# Altium project EDR_SEM_4.PrjPcb
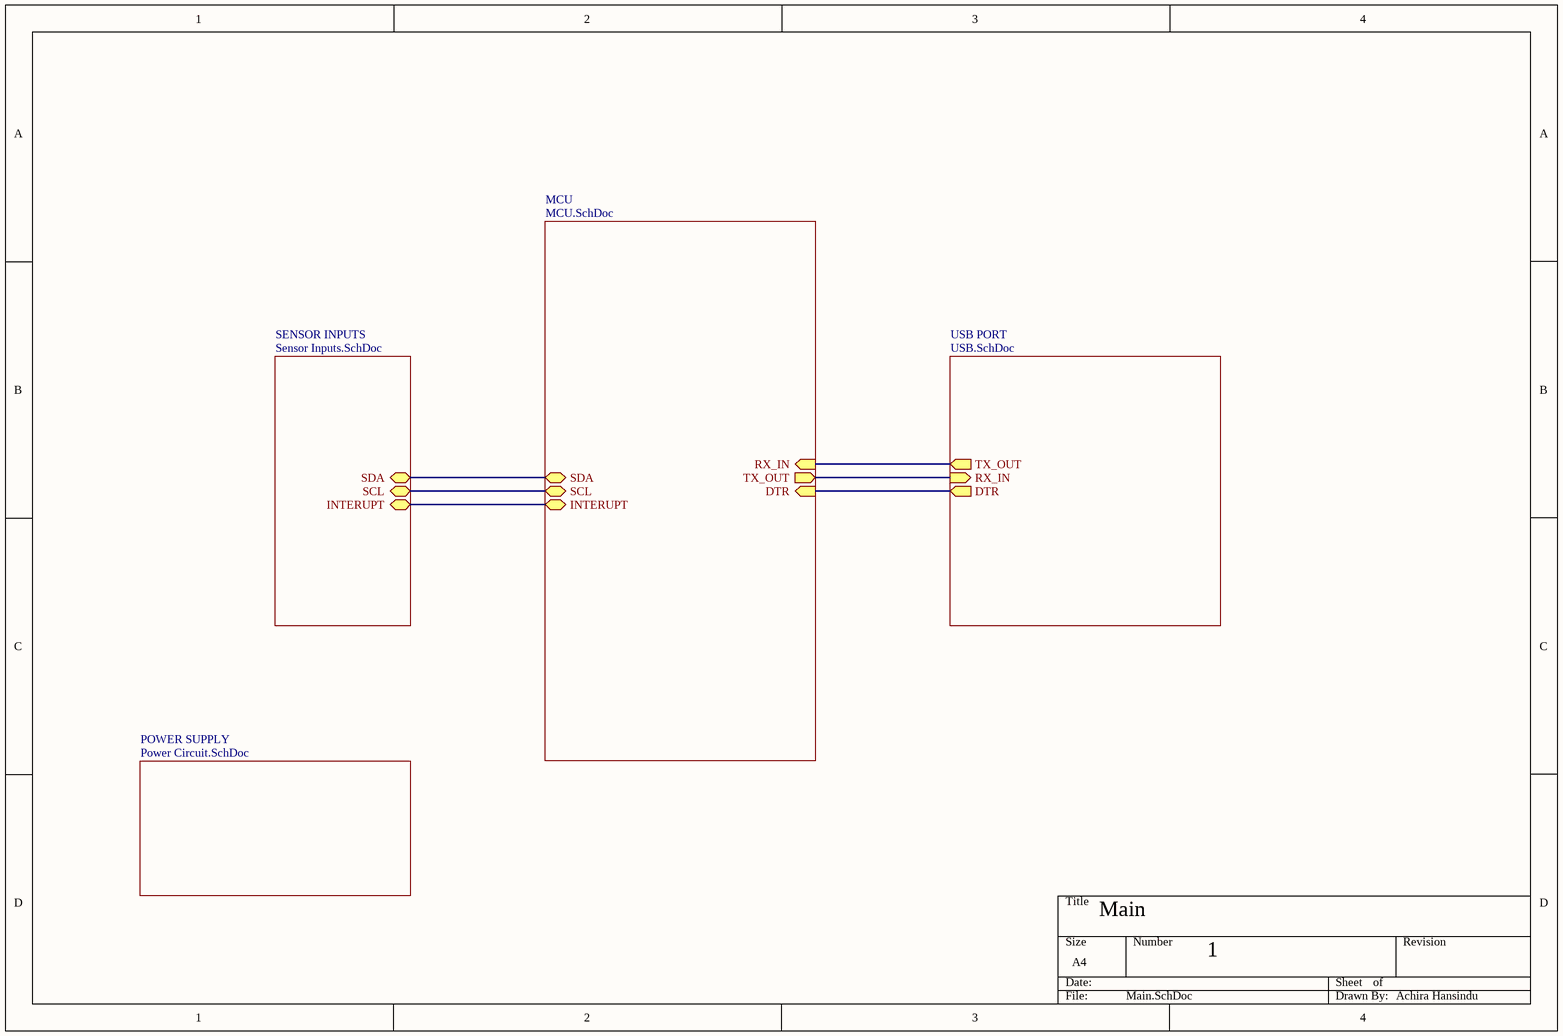
[diagram p0: Main.SchDoc]
5 sheets, 28 parts. Net scope: hierarchical (ports join the sheet entries above them; power ports are global).
Board file: PCB1.PcbDoc
Sheets:
  Main.SchDoc
    MCU = MCU.SchDoc
    POWER SUPPLY = Power Circuit.SchDoc
    SENSOR INPUTS = Sensor Inputs.SchDoc
    USB PORT = USB.SchDoc

## Sheet Main.SchDoc
size A4; SheetNumber: 1; SheetTotal: 5

### Sub-sheets
MCU = MCU.SchDoc: SDA (bidir), SCL (bidir), INTERUPT (bidir), RX_IN (in), TX_OUT (out), DTR (in)
POWER SUPPLY = Power Circuit.SchDoc: no entries
SENSOR INPUTS = Sensor Inputs.SchDoc: SDA (bidir), SCL (bidir), INTERUPT (bidir)
USB PORT = USB.SchDoc: TX_OUT (out), RX_IN (in), DTR (out)

### Nets
NetC1_1: sheet MCU/DTR, sheet USB PORT/DTR
NetD1_1: sheet MCU/TX_OUT, sheet USB PORT/RX_IN
NetD2_1: sheet MCU/RX_IN, sheet USB PORT/TX_OUT
NetJ1_2: sheet MCU/SDA, sheet SENSOR INPUTS/SDA
NetJ1_3: sheet MCU/SCL, sheet SENSOR INPUTS/SCL
NetJ1_4: sheet MCU/INTERUPT, sheet SENSOR INPUTS/INTERUPT

### Notes on the sheet
- Main
- 1
- Achira Hansindu

## Sheet MCU.SchDoc
size A4; SheetNumber: 3; SheetTotal: 5
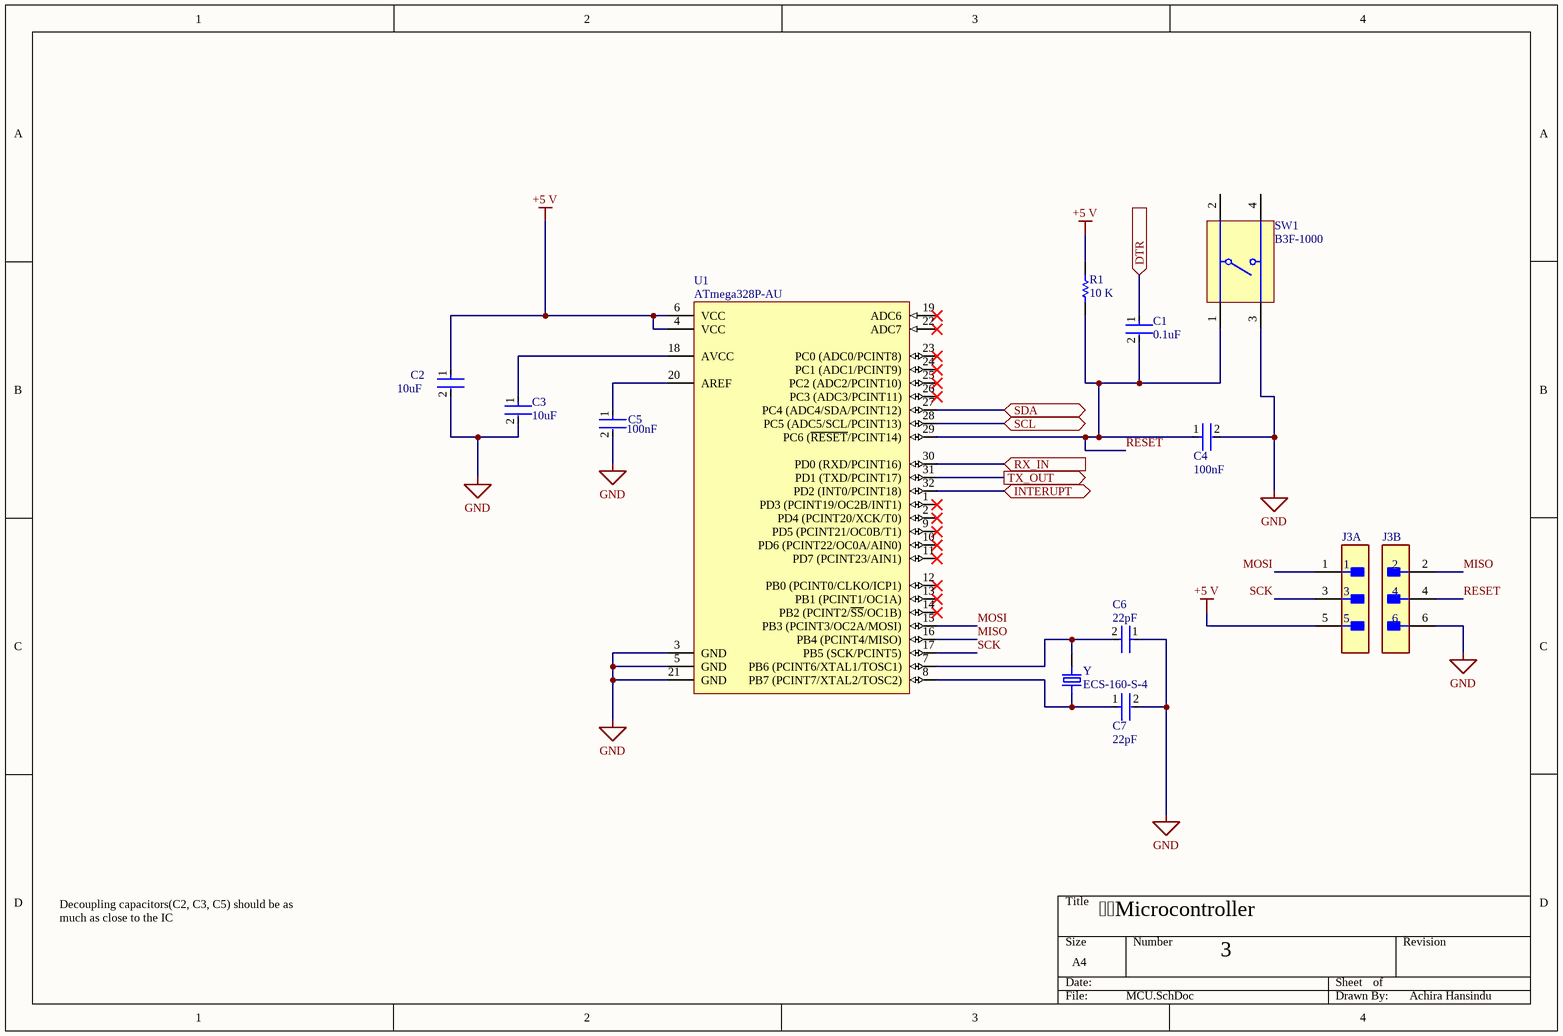
[diagram p1: MCU.SchDoc]

### Parts
C1  Capacitance: 0.1uF  [FP-GRM31M-0_15-IPC_A]  (hidden comment: GRM31M1X1H104JA01L)
C2  Capacitance: 10uF  [FP-C1206C106K4PACTU-MFG]  (hidden comment: C1206C106K4PACTU)
C3  Capacitance: 10uF  [FP-C1206C106K4PACTU-MFG]  (hidden comment: C1206C106K4PACTU)
C4  Capacitance: 100nF  [FP-CL640-IPC_C]  (hidden comment: CL05B104KO5NNWC)
C5  Capacitance: 100nF  [FP-CL640-IPC_C]  (hidden comment: CL05B104KO5NNWC)
C6  value 22pF  [FP-GRM31A-0_2-e0_3_0_8-IPC_B]  (hidden comment: GRM31A7U3D220JW31D)
C7  Capacitance: 22pF  [FP-GRM31A-0_2-e0_3_0_8-IPC_B]  (hidden comment: GRM31A7U3D220JW31D)
J3  90131-0763  [FP-90131-0763-MFG]  (value not drawn)  (parts A,B of 2)
R1  value 10 K  [RESC3216X70X50LL20T25]  (hidden comment: ERA8AEB103V)
SW1  B3F-1000  [OMRON-B3F-1000-4_V]
U1  ATmega328P-AU  [32A_M]
Y  ECS-160-S-4  [XTAL_ECS-160-20-4X]

### Ports
DTR (in, see Main[3B], USB[2B]), INTERUPT (bidir, see Main[2B], Sensor Inputs[3B]), RX_IN (in, see Main[3B]), SCL (bidir, see Main[2B], Sensor Inputs[3B]), SDA (bidir, see Main[2B], Sensor Inputs[3B]), TX_OUT (out, see Main[3B])

### Nets
+5 V: C2.1 J3.5 R1.2 U1.4(VCC) U1.6(VCC)
GND: C2.2 C3.2 C4.2 C5.2 C6.1 C7.2 J3.6 SW1.3 U1.3(GND) U1.5(GND) U1.21(GND)
MISO: J3.2 U1.16(PB4_(PCINT4/MISO))
MOSI: J3.1 U1.15(PB3_(PCINT3/OC2A/MOSI))
RESET: C1.2 C4.1 J3.4 R1.1 SW1.1 U1.29(PC6_(~{RESET}/PCINT14))
SCK: J3.3 U1.17(PB5_(SCK/PCINT5))
NetC1_1: C1.1 ; port DTR
NetC3_1: C3.1 U1.18(AVCC)
NetC5_1: C5.1 U1.20(AREF)
NetC6_2: C6.2 U1.7(PB6_(PCINT6/XTAL1/TOSC1)) Y.2
NetC7_1: C7.1 U1.8(PB7_(PCINT7/XTAL2/TOSC2)) Y.1
NetD1_1: U1.31(PD1_(TXD/PCINT17)) ; port TX_OUT
NetD2_1: U1.30(PD0_(RXD/PCINT16)) ; port RX_IN
NetJ1_2: U1.27(PC4_(ADC4/SDA/PCINT12)) ; port SDA
NetJ1_3: U1.28(PC5_(ADC5/SCL/PCINT13)) ; port SCL
NetJ1_4: U1.32(PD2_(INT0/PCINT18)) ; port INTERUPT

Not connected (* = marked no-connect by the designer): SW1 2 4; U1 1(PD3_(PCINT19/OC2B/INT1))* 2(PD4_(PCINT20/XCK/T0))* 9(PD5_(PCINT21/OC0B/T1))* 10(PD6_(PCINT22/OC0A/AIN0))* 11(PD7_(PCINT23/AIN1))* 12(PB0_(PCINT0/CLKO/ICP1))* 13(PB1_(PCINT1/OC1A))* 14(PB2_(PCINT2/~{SS}/OC1B))* 19(ADC6)* 22(ADC7)* 23(PC0_(ADC0/PCINT8))* 24(PC1_(ADC1/PCINT9))* 25(PC2_(ADC2/PCINT10))* 26(PC3_(ADC3/PCINT11))*

### Notes on the sheet
- Microcontroller
- Decoupling capacitors(C2, C3, C5) should be as much as close to the IC
- 3
- Achira Hansindu

### Library data of the parts
C1 = CMP-06035-007547-1: Chip Multilayer Ceramic Capacitors for General Purpose, 1206, 0.10uF, SL, +350/-1000ppm/°C, 5%, 50V; Dissipation Factor: 0.025%; Packaging: Tape and Reel; Length: 0.126inch; Case Code (Imperial): 1206; Voltage Rating (DC): 50V; Max Operating Temperature: 125°C; Voltage: 50V; Height: 1.15mm; Width: 0.063inch; Voltage Rating: 50V; Tolerance: 5%; Min Operating Temperature: -55°C; Mount: Surface Mount; Dielectric Material: Ceramic; Termination: SMD/SMT; Depth: 1.6mm; Case Code (Metric): 3216; Case/Package: 1206; Temperature Coefficient: -1000ppm/°C; Thickness: 0.049inch
C2 C3 = CMP-03020-034688-1: CAP CER 10UF 16V X5R 1206; Dielectric Material: Ceramic; Tolerance: 10%; Lead Free: Lead Free; Length: 3.2mm; Max Operating Temperature: 85°C; Construction: Flat; Radiation Hardening: No; Voltage Rating (DC): 16V; Min Operating Temperature: -55°C; Height: 1.6mm; Packaging: Tape and Reel; Case/Package: 1206; Voltage: 16V; Mount: Surface Mount; Dielectric: X5R; Termination: SMD/SMT; RoHS Compliant: Yes; Depth: 1.6mm
C4 C5 = CMP-13271-001008-1: Cap Ceramic 100nF 16V X7R ±10% SMD 0402 +125°C Paper T/R; Dielectric: X7R; Voltage Rating: 16V; Case Code (Metric): 1005; Case Code (Imperial): 0402; Packaging: Cut Tape; Max Operating Temperature: 125°C; Termination: Wraparound; Mount: Surface Mount; Case/Package: 0402; Package Quantity: 1; Length: 0.039inch; Min Operating Temperature: -55°C; Tolerance: 10%; Contact Plating: Tin; Width: 0.02inch; Thickness: 0.022inch
C6 C7 = CMP-06035-015250-1: Chip Multilayer Ceramic Capacitors for General Purpose, 1206, 22pF, U2J, -750ppm/°C, 5%, 2kV; Voltage Rating (DC): 2kV; Package Quantity: 4000; Case/Package: 1206; Tolerance: 5%; Voltage Rating: 2kV; Depth: 1.6mm; Width: 1.6mm; Length: 3.2mm; Radiation Hardening: No; Termination: SMD/SMT; Weight: 0.000571oz; Dielectric: U2J; Material: Ceramic; Height: 1mm; Min Operating Temperature: -55°C; Mount: Surface Mount; Thickness: 0.039inch; Case Code (Imperial): 1206; Max Operating Temperature: 125°C; Case Code (Metric): 3216; Packaging: Tape and Reel
  C6: Capacitance: 22pF
J3 = CMP-00257-00655468-1: 90131-0763 Conn Unshrouded Header HDR 6 POS 2.54mm Solder ST Top Entry Thru-Hole C-Grid III™ Tray; NexarPartId: 655468; Manufacturer Lifecycle Status: ACTIVE; Number of Poles: 6; Plating: Tin; Current Rating: 3A; Gender: Male; Voltage Rating (AC): 350V; Contact Resistance: 20mΩ; Insulation Resistance: 5GΩ; Pitch: 2.54mm; Height: 9.65mm; Mount: Through Hole; Termination: Through Hole; Contact Plating: Gold; Orientation: Vertical; Material: Glass, Polyester; Min Operating Temperature: -55°C; Lead Free: Lead Free; REACH SVHC: Unknown; Contact Material: Brass; Housing Color: Black; Schedule B: 8536694040; Number of Rows: 2; Lead Pitch: 2.54mm; Number of Circuits: 6; Number of Positions: 6; Lifecycle Status: Production; Max Operating Temperature: 125°C; Voltage Rating: 350V; Voltage Rating (DC): 350V; Country of Origin: SG; Housing Material: Polyester; RoHS: Compliant; Working Voltage: 350V; Number of Contacts: 6; Radiation Hardening: No
R1 = CMP-2003-04407-1: Manufacturer: Panasonic; Part Number: ERA8AEB103V
SW1 = CMP-011-00004-2: Tactile Switch, SPST-NO, 0.05 A, 24 V, -25 to 70 degC, 4-Pin THD, RoHS, Bulk; Manufacturer: Omron Electronic Components; Throw Configuration: SPST; Max Contact Resistance: 100mohm; Resistance: 0.1Ohm; Max Current Rating: 50mA; Voltage Rating: 24V; Operating Force: 100gf; Datasheet Version: Jan-15; Case/Package: B3F-1000; Packaging: Bulk; Package Description: 4-Pin Through Hole Device, Body 6 x 6 mm; Manufacturer URL: http://www.omron.com/; Package Reference: B3F-1000; Contact Plating: Gold; Contact Current Rating: 50mA; RoHS Compliant: True; Contact Material: Gold; Mounting Technology: TH; Max Operating Temperature: 70°C; Min Operating Temperature: -25°C; Package Quantity: 1500; Datasheet URL: http://www.omron.com/ecb/products/pdf/en-b3f.pdf; Voltage Rating (DC): 24V; Pins: 4; Current Rating: 50mA; Max Voltage Rating (DC): 24V
U1 = CMP-0095-00269-2: 8-bit AVR Microcontroller, 32KB Flash, 1KB EEPROM, 2KB SRAM, 32-pin TQFP, Industrial Grade (-40°C to 85°C); PackageDescription: 32-Lead, 7x7x1.0 mm Body, 0.8mm Lead Pitch, Thin Profile Plastic Quad Flat Package (TQFP); DatasheetVersion: revD, May-2011; RevisionNote: DatasheetVersion & PackageVersion updated. URLs added.; ComponentLink1URL: http://www.atmel.com/; ComponentLink2Description: ATmega48A/48PA/88A/88PA/168A/168PA/328/328P Datasheet; Code_JEDEC: MS-026-ABA; ComponentLink1Description: Manufacturer URL; PackageReference: 32A; ComponentLink3Description: ATmega48A/48PA/88A/88PA/168A/168PA/328/328P Summary; ComponentLink2URL: http://www.atmel.com/dyn/resources/prod_documents/doc8271.pdf; PackageVersion: revC, Oct-2010; ComponentLink3URL: http://www.atmel.com/dyn/resources/prod_documents/8271S.pdf
Y = ECS-160-S-4: 16MHz Â±30ppm Crystal Series 40 Ohms HC-49/US; MF: ECS Inc.; SnapEDA_Link: https://www.snapeda.com/parts/ECS-160-S-4/ECS%20Inc./view-part/3657575/?ref=snap; Value: *; Availability: Unavailable; Price: None; MP: ECS-160-S-4; Package: HC49/US ECS International

## Sheet Power Circuit.SchDoc
size A4; SheetNumber: 5; SheetTotal: 5
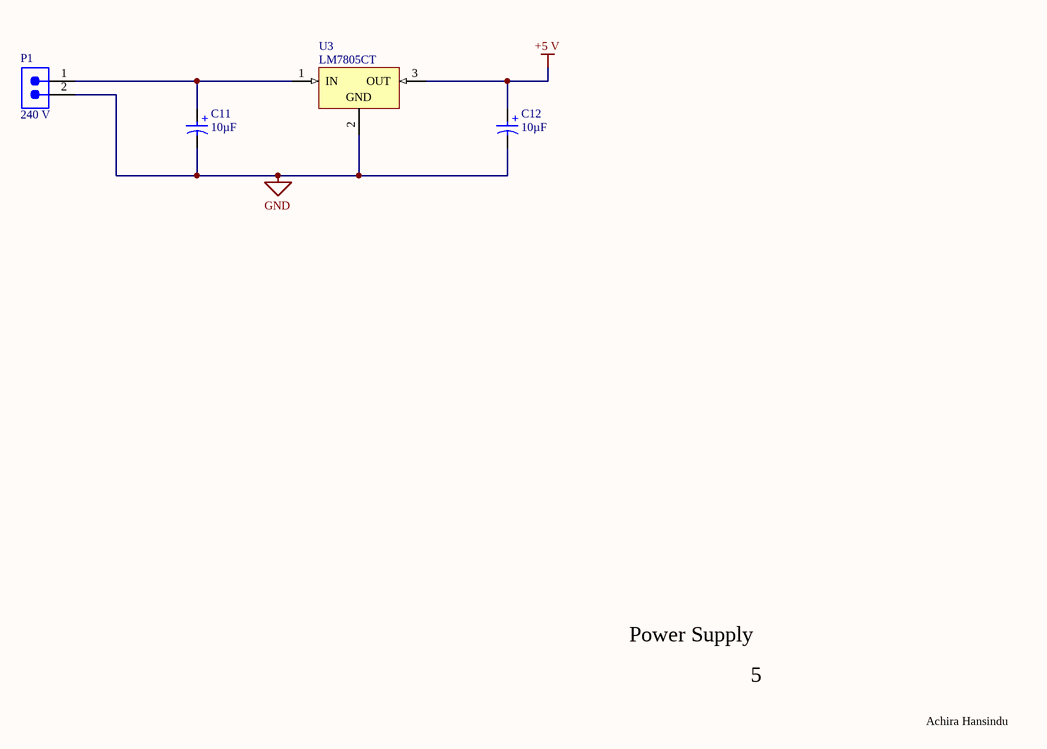
[diagram p2: Power Circuit.SchDoc]

### Parts
C11  Capacitance: 10µF  [WCAP-HTG5_D6.3H8]  (hidden comment: 870575873001)
C12  Capacitance: 10µF  [WCAP-HTG5_D6.3H8]  (hidden comment: 870575873001)
P1  240 V  [691322110002]
U3  LM7805CT  [FAIR-TO-220-3]

### Nets
+5 V: C12.1(P) U3.3(OUT)
GND: C11.2(N) C12.2(N) P1.2 U3.2(GND)
NetC11_1: C11.1(P) P1.1 U3.1(IN)

### Notes on the sheet
- Power Supply
- 5
- Achira Hansindu
- (in symbol CMP-03913-134709123-1) +

### Library data of the parts
C11 C12 = CMP-03913-134709123-1: 870575873001 Cap, 10Uf, 63V, Alu Elec, Hybrid, Rad Rohs Compliant: Yes; Pitch: 2.5mm; Hole Diameter: 900µm; ESR (Equivalent Series Resistance): 100mΩ; Leakage Current: 6.3µA; Ripple Current: 1.06A; NexarPartId: 134709123; Diameter: 6.3mm; Length: 8mm; Voltage Rating: 63V; Max Operating Temperature: 105°C; Min Operating Temperature: -55°C; RoHS: Compliant; Parameter 1: *
P1 = CMP-1502-01791-3: NexarPartId: 18818346; Voltage Rating: 300V; Number of Contacts: 2; Gender: Male; Current: 10A; Number of Levels: 1; Pitch: 3.5052mm; Termination: Solder; Lead Pitch: 3.5mm; Width: 8.1mm; Length: 10.5mm; Number of Positions Per Level: 2; Number of Pins: 2; Max Operating Temperature: 105°C; RoHS: Compliant; Current Rating: 10A; Voltage: 300V; Mount: Through Hole; Color: Green; Min Operating Temperature: -40°C; Height: 7.4mm; Number of Rows: 1; Packaging: Box; Lead Free: Lead Free; REACH SVHC: Unknown; Contact Material: Brass
U3 = CMP-2000-04938-1: Positive Voltage Regulator, 5 V, 1 A, -40 to 125 degC, 3-Pin TO-220, RoHS, Tube; Manufacturer: FairchildSemiconductor; Maximum Input Voltage: 35V; Maximum Quiescent Current: 8mA; Load Regulation: 100mV; Maximum Output Current: 2.2(Typ)A; Output Type: Fixed; Typical Dropout Voltage @ Current: 2@1AV; Rad Hard: No; Output Voltage: 5V; Accuracy: ±4%; Number of Outputs: 1; Category: LinearRegulator; Package Description: 3-Pin Through Hole Device, Body 10 x 4.5 mm, Pitch 2.54 mm; Packaging: Rail/Tube; Mounting: ThroughHole; Polarity: Positive; Manufacturer URL: https://www.fairchildsemi.com/; Line Regulation: 100mV; Datasheet Version: Aug-12; Datasheet URL: https://datasheet.ciiva.com/26904/lm7805ct-26904988.pdf; Package Reference: TO-220; Package URL: https://www.fairchildsemi.com/package-drawings/TO/TO220B03.pdf; Package: 3TO-220AB; Operating Temperature: -40to125degC; Type: Linear

## Sheet Sensor Inputs.SchDoc
size A4; SheetNumber: 2; SheetTotal: 5
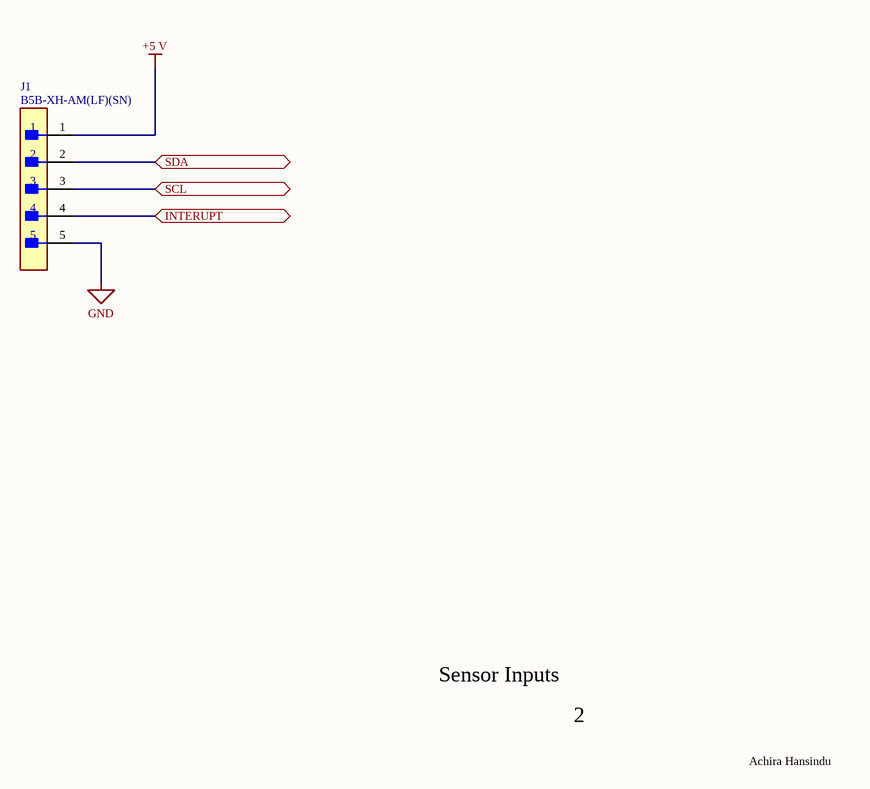
[diagram p3: Sensor Inputs.SchDoc]

### Parts
J1  B5B-XH-AM(LF)(SN)  [FP-B5B-XH-AM_LF_SN-MFG]

### Ports
INTERUPT (bidir, see Main[2B], MCU[3B]), SCL (bidir, see Main[2B], MCU[3B]), SDA (bidir, see Main[2B], MCU[3B])

### Nets
+5 V: J1.1
GND: J1.5
NetJ1_2: J1.2 ; port SDA
NetJ1_3: J1.3 ; port SCL
NetJ1_4: J1.4 ; port INTERUPT

### Notes on the sheet
- Sensor Inputs
- 2
- Achira Hansindu

### Library data of the parts
J1 = CMP-17439-000304-1: CONN HEADER VERT 5POS 2.5MM; Mated Stacking Heights: 9.8mm; Voltage Rating: 250V; Max Current Rating: 3A; Number of Positions: 5; Contact Resistance: 20mR; Depth: 5.75mm; Connector Type: Header; Color: Green; Insulation Material: Nylon; Contact Plating: Copper; Length: 14.9mm; Fastening Type: Detent; Contact Material: Brass; Number of Rows: 1; Contact Type: Male Pin; Housing Material: Polyamide; Housing Color: White; Lead Free: Lead Free; Max Voltage Rating (AC): 250V; Mount: Through Hole; Contact Shape: Square; Min Operating Temperature: -25°C; Packaging: Bulk; Orientation: Straight; Insulation Color: Natural; Series: XH; Flammability Rating: UL94 V-0; Contact Finish - Mating: TIN; Max Operating Temperature: 85°C; Termination: Solder; Pitch: 2.5mm

## Sheet USB.SchDoc
size A4; SheetNumber: 4; SheetTotal: 5
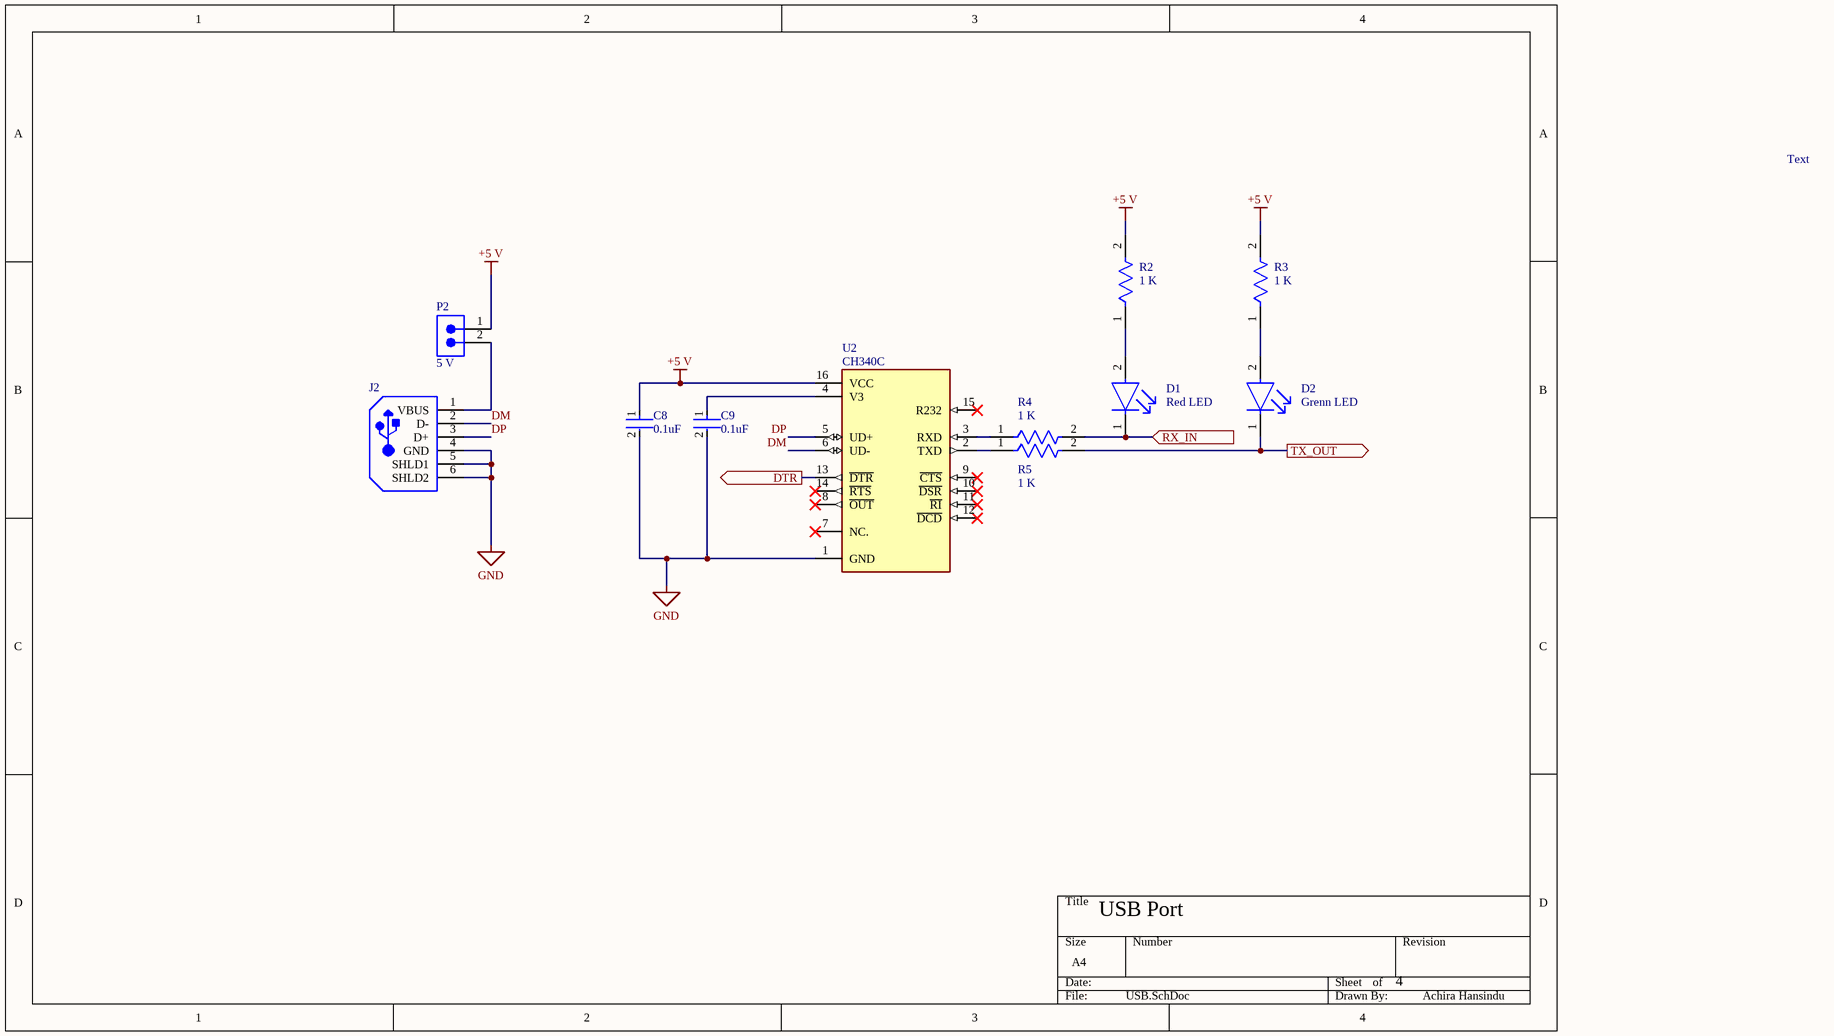
[diagram p4: USB.SchDoc]

### Parts
C8  Capacitance: 0.1uF  [FP-GRM31M-0_15-IPC_A]  (hidden comment: GRM31M1X1H104JA01L)
C9  Capacitance: 0.1uF  [FP-GRM31M-0_15-IPC_A]  (hidden comment: GRM31M1X1H104JA01L)
D1  Color: Red LED  [FP-HSMG-C150-MFG]  (hidden comment: HSMG-C150)
D2  Color: Grenn LED  [FP-HSMG-C150-MFG]  (hidden comment: HSMG-C150)
J2  292303-1  [TE-292303-1_V]  (value not drawn)
P2  5 V  [691322110002]
R2  value 1 K  [FP-CHP1206A-MFG]  (hidden comment: CHP1206AFX-1001ELF)
R3  value 1 K  [FP-CHP1206A-MFG]  (hidden comment: CHP1206AFX-1001ELF)
R4  value 1 K  [FP-CHP1206A-MFG]  (hidden comment: CHP1206AFX-1001ELF)
R5  value 1 K  [FP-CHP1206A-MFG]  (hidden comment: CHP1206AFX-1001ELF)
U2  CH340C  [SOIC127P600X180-16N]

### Ports
DTR (out, see Main[3B], MCU[3B]), RX_IN (in, see Main[3B]), TX_OUT (out, see Main[3B])

### Nets
+5 V: C8.1 P2.1 R2.2 R3.2 U2.16(VCC)
GND: C8.2 C9.2 J2.4(GND) J2.5(SHLD1) J2.6(SHLD2) U2.1(GND)
DM: J2.2(D-) U2.6(UD-)
DP: J2.3(D+) U2.5(UD+)
NetC1_1: U2.13(~{DTR}) ; port DTR
NetC9_1: C9.1 U2.4(V3)
NetD1_1: D1.1(C) R4.2 ; port RX_IN
NetD1_2: D1.2(A) R2.1
NetD2_1: D2.1(C) R5.2 ; port TX_OUT
NetD2_2: D2.2(A) R3.1
NetJ2_1: J2.1(VBUS) P2.2
NetR4_1: R4.1 U2.3(RXD)
NetR5_1: R5.1 U2.2(TXD)

Not connected (* = marked no-connect by the designer): U2 7(NC.)* 8(~{OUT})* 9(~{CTS})* 10(~{DSR})* 11(~{RI})* 12(~{DCD})* 14(~{RTS})* 15(R232)*

### Notes on the sheet
- Text
- USB Port
- 4
- Achira Hansindu

### Library data of the parts
C8 C9 = CMP-06035-007547-1: as C1 on sheet MCU; Packaging: Tape and Reel; Length: 0.126inch; Case Code (Imperial): 1206; Voltage Rating (DC): 50V; Max Operating Temperature: 125°C; Voltage: 50V; Height: 1.15mm; Width: 0.063inch; Voltage Rating: 50V; Tolerance: 5%; Min Operating Temperature: -55°C; Mount: Surface Mount; Dielectric Material: Ceramic; Termination: SMD/SMT; Depth: 1.6mm; Case Code (Metric): 3216; Case/Package: 1206; Temperature Coefficient: -1000ppm/°C; Thickness: 0.049inch
D1 D2 = CMP-2000-05061-2: LED GREEN DIFFUSED 1206 SMD; Manufacturer: Broadcom; Led Orientation: Top View; Max Junction Temp: +95°C; Peak Emmision Wavelength: 570nm; Viewing Angle: 170°; Wavelength: 572nm; Reverse Voltage: 5V; Luminous Intensity: 15mcd; Forward Voltage: 2.2V; Power Dissipation: 65mW; Forward Current: 20mA; ComponentLink2Description: Datasheet; Lead Free: Yes; Temperature Range Low: -40°C; Package: HSMG-C150; Digikey Description: LED GREEN DIFFUSED 1206 SMD; Mouser Description: LED Uni-Color Green 570nm 2-Pin Chip LED T/R; Manufacturer Part Number: HSMG-C150; Temperature Range High: +85°C; Device Class L1: Optoelectronics; Colour: Green; Category: Diode; Device Class L3: unset; RoHS: TRUE; Height: 1.2mm; ComponentLink2URL: https://docs.broadcom.com/docs/AV02-0551EN; Device Class L2: LEDs; Automotive: No; Ipc Land Pattern Name: DIOCP320160X55; Octopart: https://octopart.com/hsmg-c150-broadcom-71131304; Temperature: -40°C to +85°C
J2 = CMP-2000-05404-1: 1 Port Right Angle Through Hole Mount Female Type A USB Connector, 4 Position, -55 to 85 degC, RoHS, Tube; Manufacturer: TE Connectivity; Contact Termination Type: Solder; No. of Contacts: 4; Connector Mounting: PCB; SVHC: NoSVHC(16-Jun-2014); Gender: Receptacle; Connector Type: USBA; Package Description: 4-Pin Through Hole Device, Body 14 x 13.13 mm, Pitch 2.5 mm; Contact Plating: Gold; Package Reference: 292303-1; Contact Material: Copper; Datasheet URL: http://www.farnell.com/cad/1653030.pdf; Datasheet Version: Feb-12; Manufacturer URL: http://www.te.com/
P2 = CMP-1502-01791-3: as P1 on sheet Power Circuit; Termination: Solder; Lead Pitch: 3.5mm; Width: 8.1mm; Length: 10.5mm; Number of Positions Per Level: 2; Number of Pins: 2; Max Operating Temperature: 105°C; RoHS: Compliant; Current Rating: 10A; Voltage: 300V; Mount: Through Hole; Color: Green; Min Operating Temperature: -40°C; Height: 7.4mm; Number of Rows: 1; Packaging: Box; Lead Free: Lead Free; REACH SVHC: Unknown; Contact Material: Brass
R2-R5 = CMP-07231-007505-1: RESHIGHPOWERA 1206 1K 1% 3/4W TC
U2 = CH340C: USB to serial chip CH340; MF: WCH; Price: None; Availability: Not in stock; MP: CH340C; Package: None; SnapEDA_Link: https://www.snapeda.com/parts/CH340C/WCH/view-part/?ref=snap; Check_prices: https://www.snapeda.com/parts/CH340C/WCH/view-part/?ref=eda; Value: *

## Nets that join several sheets
+5 V: MCU (5 pins), Power Circuit (C12.1 U3.3), Sensor Inputs (J1.1), USB (5 pins)
GND: MCU (11 pins), Power Circuit (C11.2 C12.2 P1.2 U3.2), Sensor Inputs (J1.5), USB (6 pins)
NetC1_1: MCU (C1.1), USB (U2.13)
NetD1_1: MCU (U1.31), USB (D1.1 R4.2)
NetD2_1: MCU (U1.30), USB (D2.1 R5.2)
NetJ1_2: MCU (U1.27), Sensor Inputs (J1.2)
NetJ1_3: MCU (U1.28), Sensor Inputs (J1.3)
NetJ1_4: MCU (U1.32), Sensor Inputs (J1.4)